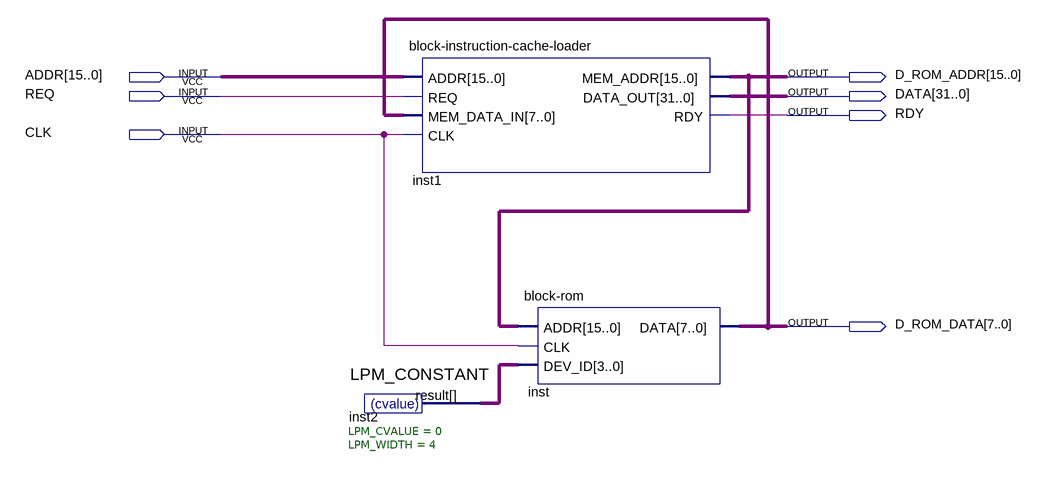
[diagram p0: schematic sheet]
// Quartus schematic test-block-instruction-cache-loader.bdf as structural Verilog: 3 symbols, 7 pins
module \test-block-instruction-cache-loader  (
  input  [15:0] ADDR,
  input  REQ,
  input  CLK,
  output [15:0] D_ROM_ADDR,
  output [31:0] DATA,
  output RDY,
  output [7:0] D_ROM_DATA
);

  wire [3:0] inst2_result;

  LPM_CONSTANT #(.LPM_CVALUE(0), .LPM_WIDTH(4)) inst2 (.result(inst2_result));
  \block-instruction-cache-loader  inst1 (
    .ADDR(ADDR), .REQ(REQ), .MEM_DATA_IN(D_ROM_DATA), .CLK(CLK), .MEM_ADDR(D_ROM_ADDR), .DATA_OUT(DATA),
    .RDY(RDY));
  \block-rom  inst (.ADDR(D_ROM_ADDR), .CLK(CLK), .DEV_ID(inst2_result), .DATA(D_ROM_DATA));
endmodule
